# EAGLE design Adafruit VS1053 Breakout (EAGLE 6.4)
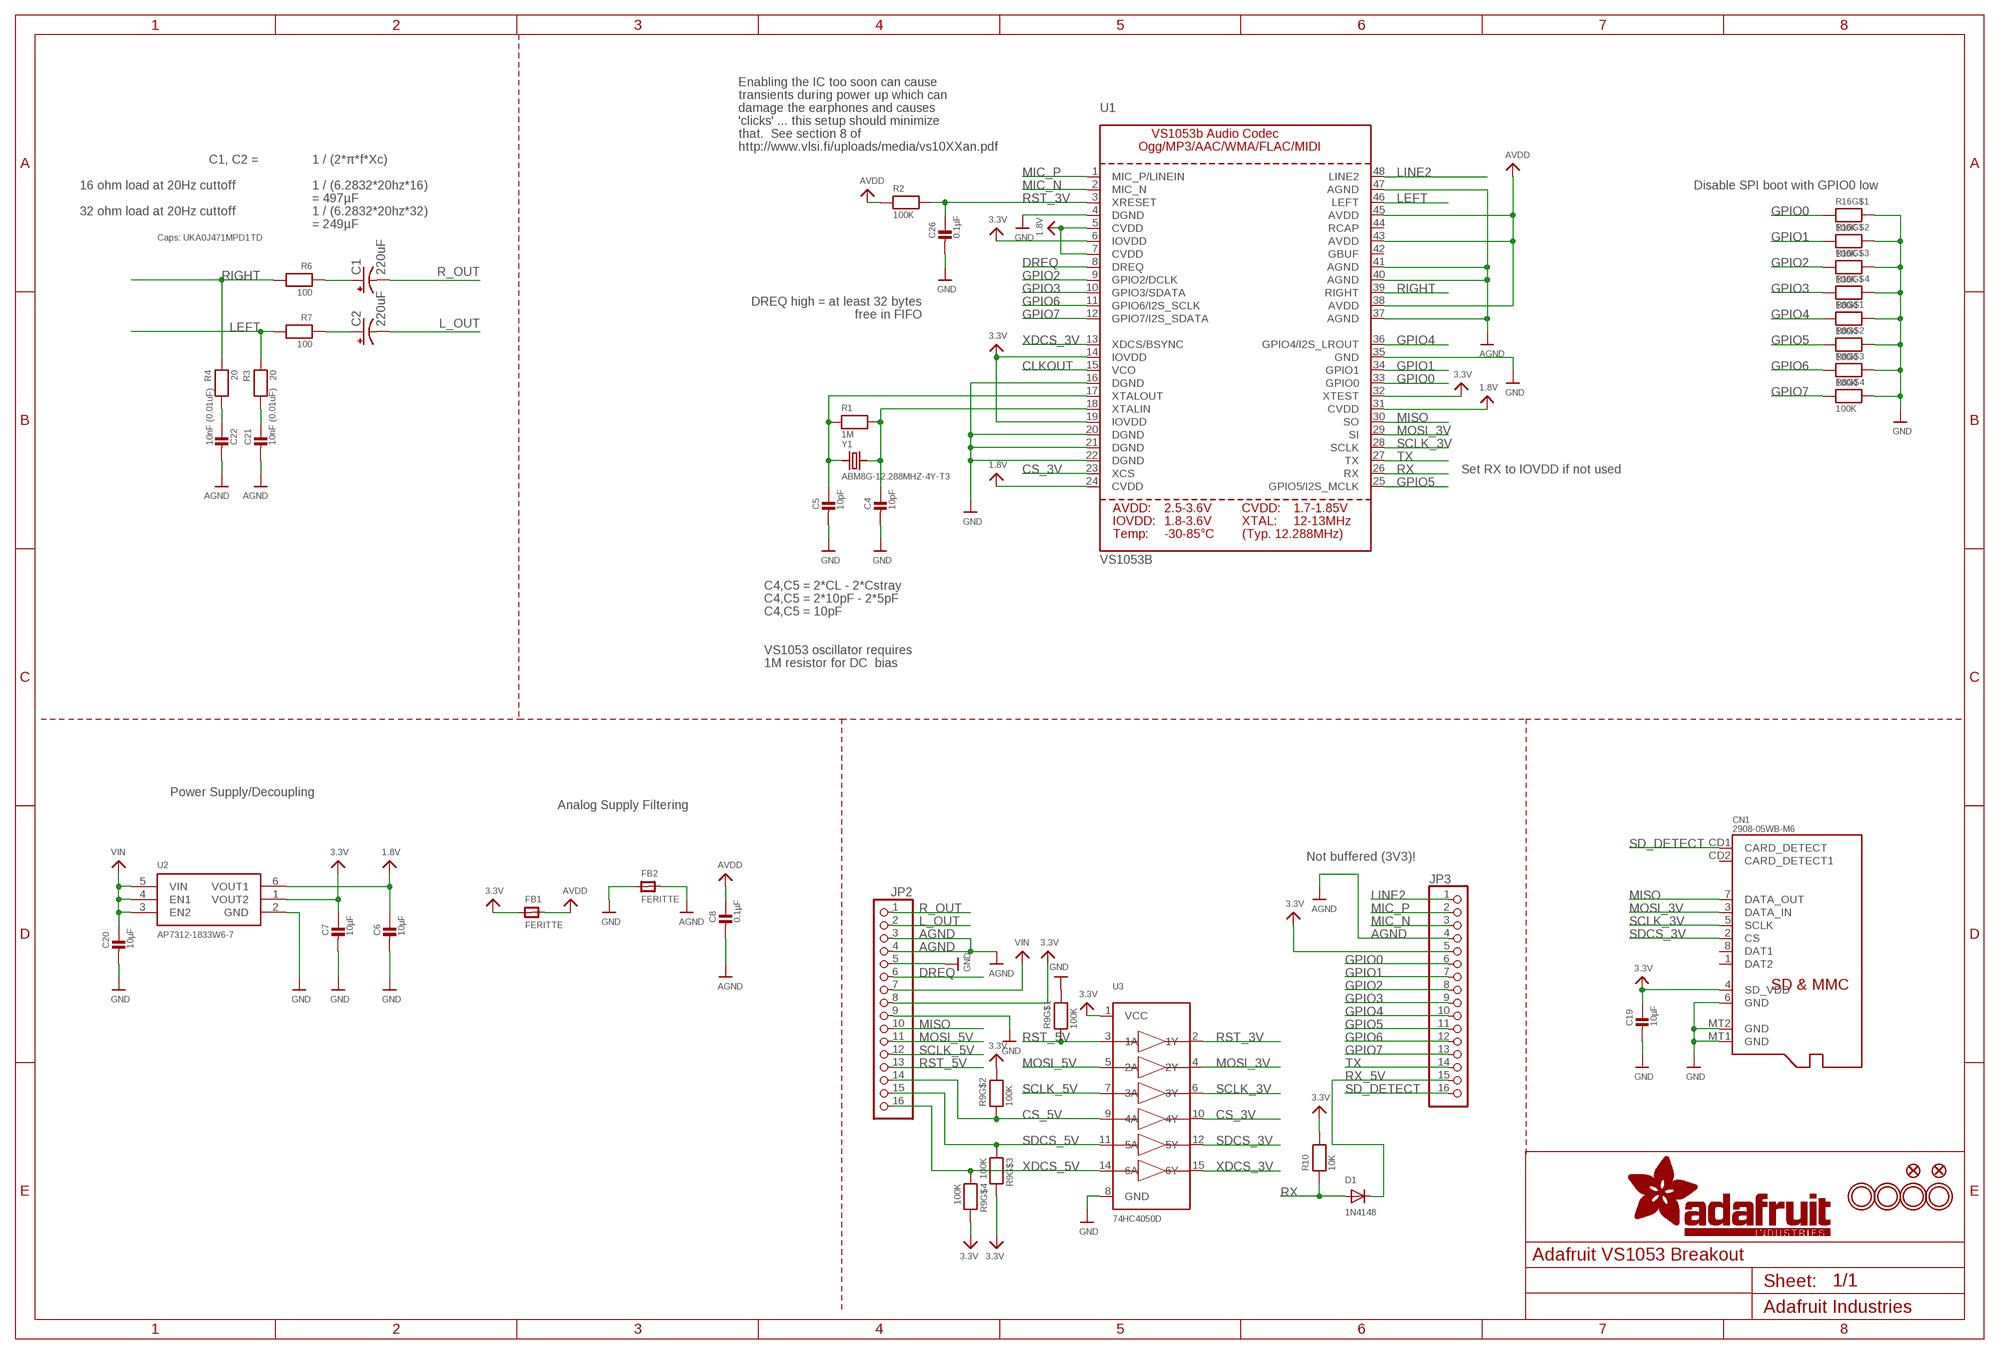
[diagram p0: schematic, sheet 1]

## Parts
C1  220uF  CPOL-USC  [PANASONIC_C]
C2  220uF  CPOL-USC  [PANASONIC_C]
C4  10pF  CAP_CERAMIC_0805MP  [_0805MP]
C5  10pF  CAP_CERAMIC_0805MP  [_0805MP]
C6  10µF  CAP_CERAMIC_0805MP  [_0805MP]
C7  10µF  CAP_CERAMIC_0805MP  [_0805MP]
C8  0.1µF  CAP_CERAMIC_0805MP  [_0805MP]
C19  10µF  CAP_CERAMIC_0805MP  [_0805MP]
C20  10µF  CAP_CERAMIC_0805MP  [_0805MP]
C21  10nF (0.01uF)  CAP_CERAMIC_0805MP  [_0805MP]
C22  10nF (0.01uF)  CAP_CERAMIC_0805MP  [_0805MP]
C26  0.1µF  CAP_CERAMIC_0805MP  [_0805MP]
CN1  2908-05WB-M6  MICROSD  [MICROSD]
D1  1N4148  DIODESOD-323  [SOD-323]
FB1  FERITTE  FERRITE_0805MP  [_0805MP]
FB2  FERITTE  FERRITE_0805MP  [_0805MP]
FID1  FIDUCIAL""  [FIDUCIAL_1MM]
FID2  FIDUCIAL""  [FIDUCIAL_1MM]
JP2  HEADER-1X16ROUND  [1X16_ROUND]
JP3  HEADER-1X16ROUND  [1X16_ROUND]
R1  1M  RESISTOR_0805MP  [_0805MP]
R2  100K  RESISTOR_0805MP  [_0805MP]
R3  20  RESISTOR_0805MP  [_0805MP]
R4  20  RESISTOR_0805MP  [_0805MP]
R6  100  RESISTOR_0805MP  [_0805MP]
R7  100  RESISTOR_0805MP  [_0805MP]
R8  100K  RESISTOR_4PACK  [RESPACK_4X0603]
R9  100K  RESISTOR_4PACK  [RESPACK_4X0603]
R10  10K  RESISTOR0805_NOOUTLINE  [0805-NO]
R16  100K  RESISTOR_4PACK  [RESPACK_4X0603]
U1  VS1053B  [LQFP48]
U2  AP7312-1833W6-7  VREG_SOT23-6_DUALAP7312  [SOT23-6]
U3  74HC4050D  [SOIC16]
U$50  MOUNTINGHOLE3.0THIN  [MOUNTINGHOLE_3.0_PLATEDTHIN]
U$51  MOUNTINGHOLE3.0THIN  [MOUNTINGHOLE_3.0_PLATEDTHIN]
U$52  MOUNTINGHOLE3.0THIN  [MOUNTINGHOLE_3.0_PLATEDTHIN]
U$53  MOUNTINGHOLE3.0THIN  [MOUNTINGHOLE_3.0_PLATEDTHIN]
Y1  ABM8G-12.288MHZ-4Y-T3  CRYSTAL3.2X2.5  [CRYSTAL_3.2X2.5]

## Nets
1.8V: C6.1 U1.5(CVDD) U1.7(CVDD) U1.24(CVDD) U1.31(CVDD) U2.6(VOUT1)
3.3V: C7.1 C19.1 CN1.4(SD_VDD) FB1.1 JP2.8 JP3.5 R9.5 R9.6 R9.7 R10.2 U1.6(IOVDD) U1.14(IOVDD) U1.19(IOVDD) U1.32(XTEST) U2.1(VOUT2) U3.1(VCC)
AGND: C8.2 C21.2 C22.2 FB2.2 JP2.3 JP2.4 JP3.4 U1.37(AGND) U1.40(AGND) U1.41(AGND) U1.47(AGND)
AVDD: C8.1 FB1.2 R2.1 U1.38(AVDD) U1.43(AVDD) U1.45(AVDD)
CLKOUT: U1.15(VCO)
CS_3V: U1.23(XCS) U3.10(4Y)
CS_5V: JP2.14 R9.2 U3.9(4A)
DREQ: JP2.6 U1.8(DREQ)
GND: C4.2 C5.2 C6.2 C7.2 C19.2 C20.2 C26.2 CN1.6(GND) CN1.MT1(GND) CN1.MT2(GND) FB2.1 JP2.5 JP2.9 R8.5 R8.6 R8.7 R8.8 R9.8 R16.5 R16.6 R16.7 R16.8 U1.4(DGND) U1.16(DGND) U1.20(DGND) U1.21(DGND) U1.22(DGND) U1.35(GND) U2.2(GND) U3.8(GND)
GPIO0: JP3.6 R16.1 U1.33(GPIO0)
GPIO1: JP3.7 R16.2 U1.34(GPIO1)
GPIO2: JP3.8 R16.3 U1.9(GPIO2/DCLK)
GPIO3: JP3.9 R16.4 U1.10(GPIO3/SDATA)
GPIO4: JP3.10 R8.1 U1.36(GPIO4/I2S_LROUT)
GPIO5: JP3.11 R8.2 U1.25(GPIO5/I2S_MCLK)
GPIO6: JP3.12 R8.3 U1.11(GPIO6/I2S_SCLK)
GPIO7: JP3.13 R8.4 U1.12(GPIO7/I2S_SDATA)
L_OUT: C2.- JP2.2
LEFT: R3.1 R7.2 U1.46(LEFT)
LEFT_FILTERED: C2.+ R7.1
LINE2: JP3.1 U1.48(LINE2)
MIC_N: JP3.3 U1.2(MIC_N)
MIC_P: JP3.2 U1.1(MIC_P/LINEIN)
MISO: CN1.7(DATA_OUT) JP2.10 U1.30(SO)
MOSI_3V: CN1.3(DATA_IN) U1.29(SI) U3.4(2Y)
MOSI_5V: JP2.11 U3.5(2A)
N$1: C5.1 R1.1 U1.17(XTALOUT) Y1.1
N$2: C4.1 R1.2 U1.18(XTALIN) Y1.2
N$5: C21.1 R3.2
N$6: C22.1 R4.2
R_OUT: C1.- JP2.1
RIGHT: R4.1 R6.2 U1.39(RIGHT)
RIGHT_FILTERED: C1.+ R6.1
RST_3V: C26.1 R2.2 U1.3(XRESET) U3.2(1Y)
RST_5V: JP2.13 R9.1 U3.3(1A)
RX: D1.A R10.1 U1.26(RX)
RX_5V: D1.C JP3.15
SCLK_3V: CN1.5(SCLK) U1.28(SCLK) U3.6(3Y)
SCLK_5V: JP2.12 U3.7(3A)
SD_DETECT: CN1.CD1(CARD_DETECT) JP3.16
SDCS_3V: CN1.2(CS) U3.12(5Y)
SDCS_5V: JP2.15 R9.3 U3.11(5A)
TX: JP3.14 U1.27(TX)
VIN: C20.1 JP2.7 U2.3(EN2) U2.4(EN1) U2.5(VIN)
XDCS_3V: U1.13(XDCS/BSYNC) U3.15(6Y)
XDCS_5V: JP2.16 R9.4 U3.14(6A)
Unconnected: CN1.1(DAT2) CN1.8(DAT1) CN1.CD2(CARD_DETECT1) U1.42(GBUF) U1.44(RCAP)

## Notes on the sheet
- Enabling the IC too soon can cause
- transients during power up which can
- damage the earphones and causes
- 'clicks' ... this setup should minimize
- that.  See section 8 of
- http://www.vlsi.fi/uploads/media/vs10XXan.pdf
- C1, C2 = | 1 / (2*π*f*Xc)
- 16 ohm load at 20Hz cuttoff | 1 / (6.2832*20hz*16) | Disable SPI boot with GPIO0 low
- = 497µF
- 32 ohm load at 20Hz cuttoff | 1 / (6.2832*20hz*32)
- = 249µF
- Caps: UKA0J471MPD1TD
- DREQ high = at least 32 bytes
- free in FIFO
- Set RX to IOVDD if not used
- C4,C5 = 2*CL - 2*Cstray
- C4,C5 = 2*10pF - 2*5pF
- C4,C5 = 10pF
- VS1053 oscillator requires
- 1M resistor for DC  bias
- Power Supply/Decoupling
- Analog Supply Filtering
- Not buffered (3V3)!

## Library data of the parts
C1 C2 = rcl:CPOL-US: POLARIZED CAPACITOR, American symbol
C4-C8 C19-C22 C26 = microbuilder:CAP_CERAMIC: Ceramic Capacitors For new designs, use the packages preceded by an '_' character since they are more reliable: The following footprints should be used on most boards: _0402 - Standard footprint for regular board layouts _0603 - Standard footprint for regular board layouts _0805 - Standard footprint for regular board layouts For extremely tight-pitch boards where space is at a premium, the following 'micro-pitch' footprints can be used (smaller pads, no silkscreen outline, etc.): _0402MP - Micro-pitch footprint for very dense/compact boards _0603MP - Micro-pitch footprint for very dense/compact boards _0805MP - Micro-pitch footprint for very dense/compact boards Commonly Stocked Parts 0402 - 0402 Surface Mount Capacitors 16pF 50V 5% [Digikey: 445-4899-2-ND] 18pF 50V 5% [Digikey: 490-1281-2-ND] 22pF 50V 5% [Digikey: 490-1283-2-ND] 68pF 50V 5% [Digikey: 490-1289-2-ND] 0.1uF 10V 10% [Digikey: 490-1318-2-ND] 1.0uF 6.3V 10% [Digikey: 490-1320-2-ND] 0603 - 0603 Surface Mount Capacitors 16 pF 50V 5% [Digikey: 445-5051-2-ND] 22 pF 50V [Digikey: PCC220ACVTR-ND] 33 pF 50V 5% [Digikey: 490-1415-1-ND] 56pF 50V 5% [Digikey: 490-1421-1-ND] 220pF 50V 5% [Digikey: 445-1285-1-ND] 680 pF 50V 2200 pF 50V 5% C0G [Digikey: 445-1297-1-ND] 5600 pF 100V 5% X7R [Digikey: 478-3711-1-ND] 0.1 µF 25V 10% [Digikey: PCC2277TR-ND] 0.22 µF 16V 10% X7R [Digikey: 445-1318-1-ND] 1.0 µF 25V 10% [Digikey: 445-5146-2-ND] 0603 - RF Specific 3pF 250V +/-0.1pF RF [Digikey: 712-1347-1-ND] 18 pF 250V 5% [Digikey: 478-3505-1-ND or 712-1322-1-ND] 56 pF 250V 5% C0G RF [Digikey: 490-4867-1-ND] 68 pF 250V RF [Digikey: 490-4868-1-ND] 0805 - 0805 Surface Mount Capacitors 220 pF 250V 2% RF Ceramic Capacitor [Digikey: 712-1398-1-ND] 1000 pF 50V 2% NP0 Ceramic Capacitor [Digikey: 478-3760-1-ND] 0.1 µF 25V 10% Ceramic Capacitor [Digikey: PCC1828TR-ND] 1.0 µF 16V 10% Ceramic Capacitor[Digikey: 490-1691-2-ND] 10.0 µF 10V 10% Ceramic Capacitor[Digikey: 709-1228-1-ND] 10.0 uF 16V 10% Ceramic Capacitor [Digikey: 478-5165-2-ND] 47 uF 6.3V 20% Ceramic Capacitor [Digikey: 587-1779-1-ND or 399-5506-1-ND] 1206 - 1206 Surface Mount Capacitors 47uF 10V 20% Ceramic Capacitor [Digikey: 490-5528-1-ND or 399-5508-1-ND or 445-6010-1-ND] 100uF 6.3V -20%, +80% Y5V Ceramic Capacitor (Digikey: 490-4512-1-ND, Mouser: 81-GRM31CF50J107ZE1L)
CN1 = microbuilder:MICROSD: MicroSD/Transflash Card Holder with SPI pinout 3M: 2908-05WB-MG 4UConnector: 19656 Footprint courtesy: Adafruit Industries
D1 = microbuilder:DIODE: Diode SMA Model Volts Amps Type Vf Vr Digikey # Notes SSA34-E3 40V 3A Schottky 480mV @ 3A 200uA @ 40V SSA34-E3/61TGITR-ND CDBA120-G 20V 1A Schottky 500mV @ 1A 500uA @ 20V 641-1014-6-ND REEL MBRA210 10V 2A Schottky 350mV @ 2A 700uA @ 10V MBRA210LT3 SOD-123 Model Volts Amps Type Vf Vr Order # Notes BAT54T1G 30V 200mA Schottky 800mV @ 200mA 2uA @ 25V BAT54T1GOSTR-ND B0530W 30V 500mA Schottky 430mV @ 500mA 130uA @ 30V B0530W-FDICT-ND REEL MBR120 20V 1A Schottky 340mV @ 1A MBR120VLSFT1GOSCT-ND SOD-323 Model Volts Amps Type Vf Vr Order # Notes PMEG2005EJ 20V 500mA Schottky 355mV @ 500mA 568-4110-1-ND ZLLS410 10V 570mA Schottky 380mV @ 570mA ZLLS410CT-ND 1N4148WS 75V 150mA Silicon/Simple 1V 1N4148WSFSCT-ND REEL SOD-523 Model Volts Amps Type Vf Vr Order # Notes BAT54XV2 30V 200mA Schottky 0.8V @ 100mA BAT54XV2CT-ND TB751S 30V 30mA Schottky RB751S-40TE61CT-ND SOT23-R/W (R = Solder Paste/Reflow Ovens, W = Hand-Soldering) Model Volts Amps Type Vf Vr Order # Notes BAT54FILM 40V 300mA Schottky 497-7162-1-ND
FB1 FB2 = microbuilder:FERRITE: Ferrite Bead 0603 MMZ1608B121C - 120 Ohm @ 100MHz, 600mA, 0.15 Ohm DC Resistance - Digikey: 445-2164-1-ND BK1608HW121-T - 120 Ohm, 600mA Ferrite Chip - Digikey: 587-1876-2-ND 0805 HZ0805B272R-10 - 2.7K Ohm @ 100MHz, 200mA, 0.8 Ohm DC Resistance - Digikey: 240-2504-1-ND (see also Murata BLM21BD272SN1L) MMZ2012Y152B - 1.5K Ohm @ 100MHz, 500mA, 0.4 Ohm DC Resistance - Digikey: 445-1560-1-ND - Mainly for high frequency (80-400MHz) MMZ2012R102A - 1K Ohm @ 100MHz, 500mA, 0.3 Ohm DC Resistance - Digikey: 445-1555-2-ND - More general purpose (10-200MHz)
FID1 FID2 = microbuilder:FIDUCIAL: Fiducial Alignment Points Various fiducial points for machine vision alignment.; BOM: EXCLUDE
JP2 JP3 = microbuilder:HEADER-1X16: PIN HEADER
R1-R4 R6 R7 R10 = microbuilder:RESISTOR: Resistors For new designs, use the packages preceded by an '_' character since they are more reliable: The following footprints should be used on most boards: _0402 - Standard footprint for regular board layouts _0603 - Standard footprint for regular board layouts _0805 - Standard footprint for regular board layouts For extremely tight-pitch boards where space is at a premium, the following 'micro-pitch' footprints can be used (smaller pads, no silkscreen outline, etc.): _0402MP - Micro-pitch footprint for very dense/compact boards _0603MP - Micro-pitch footprint for very dense/compact boards _0805MP - Micro-pitch footprint for very dense/compact boards
R8 R9 R16 = microbuilder:RESISTOR_4PACK: Resistor Packs (4 resistors) 4 x 0603 10K 1/16W - Digikey: YC164J-10KCT-ND
U1 = microbuilder:VS1053B: VS1053b Audio Codec - Ogg Vorbis/MP3/AAC/WMA/FLAC/MIDI
U2 = microbuilder:VREG_SOT23-6_DUAL: Dual Output SOT23-6 Linear Regulators Diodes Inc. AP7312 - Dual 150mA LDO Linear Regulator 0.2V dropout, 150mA output, 2-6V Input AP7312-1833W6-7 - 1.8V/3.3V SOT23-6 (Digikey: AP7312-1833W6-7DICT-ND) MIC5320 - Dual 150mA ULDO Linear Regulator Ultra-low 35mV dropout at 150mA, 2.3-5.5V Input 3.3V/1.8V SOT23-6 (Digikey: 576-1658-1-ND) 3.3V/1.5V SOT23-6 (Digikey: 576-3483-1-ND)
U3 = microbuilder:74HC4050D: 6-channel level shifter 74HC4050D - 2V-6V Supply SOIC16 Digikey: 74HC4050D,653-ND Mouser: 771-74HC4050D-T TSSOP16 Digikey: 296-9215-1-ND Mouser:
U$50-U$53 = microbuilder:MOUNTINGHOLE: Mounting Hole For #2 screws (0.086"/2.18mm width, 0.094"/2.4mm hole) use 2.5mm; BOM: EXCLUDE
Y1 = microbuilder:CRYSTAL: Crystals HC49UP - Surface Mount Crystal 4.0MHz 18pF +/-30ppm Surface Mount Crystal [Digikey: 535-9857-1-ND] 12.0 MHz Surface Mount Crystal [Digikey: 535-9869-6-ND] 25.0 MHz Surface Mount Crystal [Digikey: 535-9078-1-ND] 2.5 x 2.0mm - MEMs SMT Crystal 16.0 MHz 10pF 20ppm 2.5 x 2.0mm Crystal [Digikey -40-85°C: 535-10923-1-ND] 3.2 x 2.5mm - MEMs SMT Crystal 12.0 MHz 8pF 15ppm 3.2 x 2.5mm Crystal [Digikey: -10-70°C: 644-1047-1-ND -40-125°C: 644-1128-1-ND] 40~85°C cheaper: 644-1173-6-ND 16.0 MHz 8pF 15ppm 3.2 x 2.5mm Crystal [Digikey: -10-70°C: 644-1049-1-ND -40-125°C: 644-1129-2-ND]-40~85°C cheaper: 644-1175-6-ND 16.0 MHz 10pF 10ppm 3.2 x 2.5mm Crystal [Digikey: 644-1100-1-ND] 27.12 MHz 18pF 30ppm 3.2 x 2.5mm Crystal [Digikey: 887-1424-1-ND] 27.12MHz 10pF 10ppm 3.2 x 2.5mm Crystal [Digikey: 887-1329-1-ND] 4.9 x 1.8mm - MEMs SMT Crystal 32.768 KHz 12.5pF 20ppm 4.9 x 1.8mm Crystal [Digikey: SE2415CT-ND] 8.0 x 3.8mm - Surface Mount Crystal 32.768kHz 12.5pF 20ppm -40°C-85°C [Digikey: 535-9166-2-ND] Cylinder 32.768KHz Cylinder Crystal (2x6mm body) [Ex. Digikey: 300-8341-2-ND]

## Board
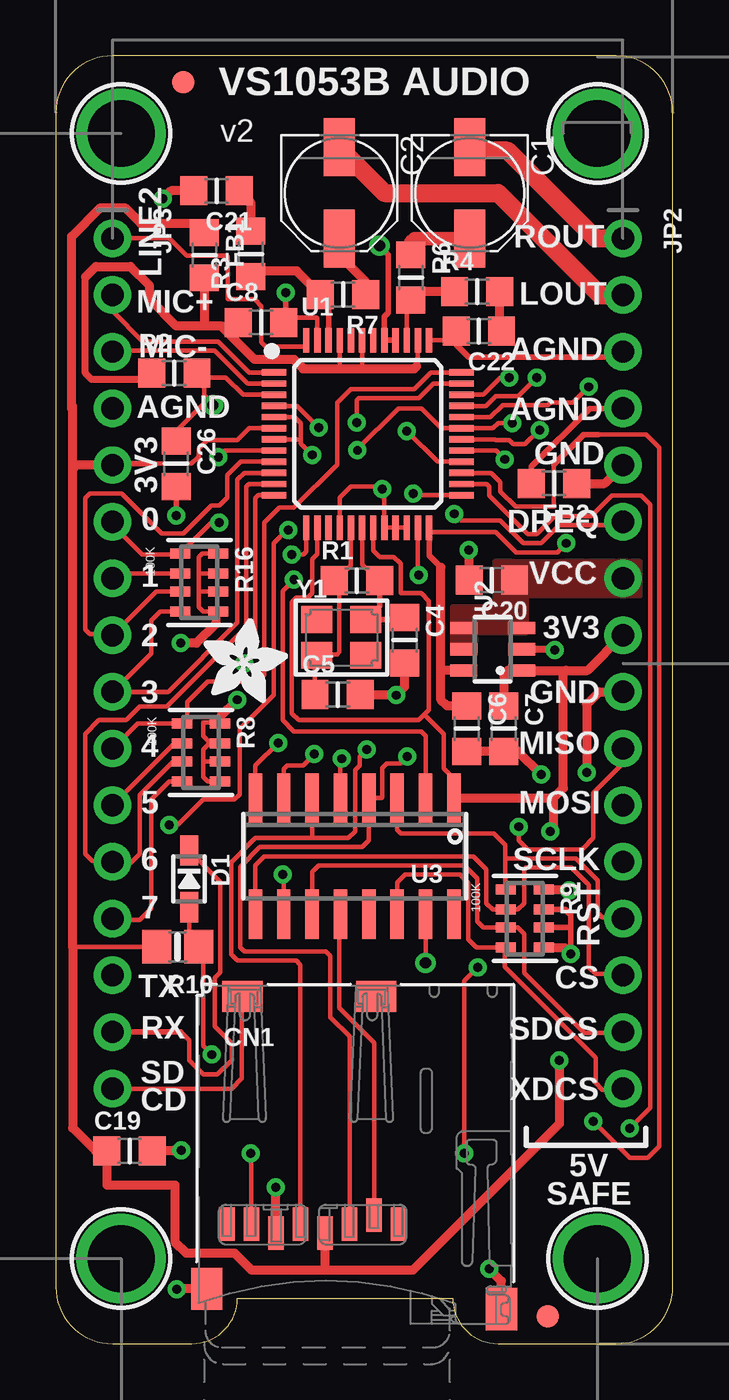
[diagram p1: board, top side]
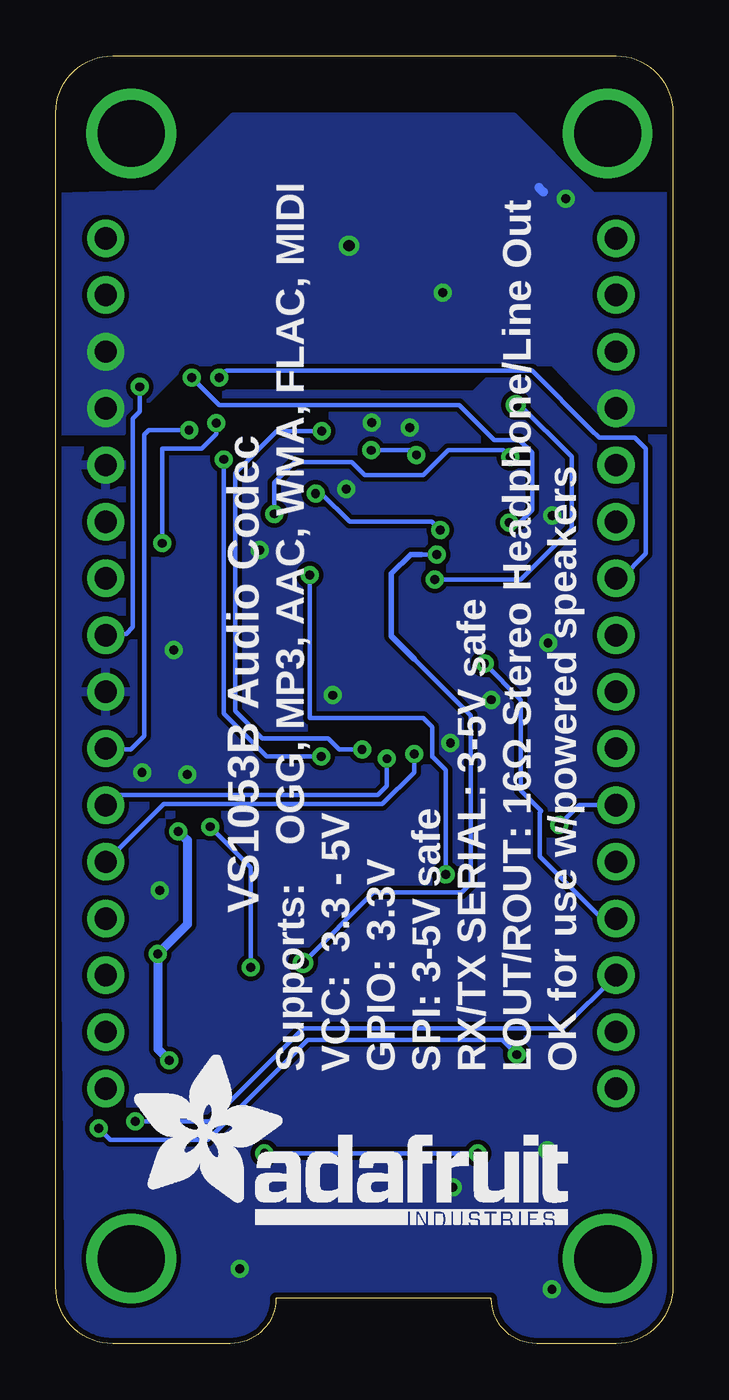
[diagram p2: board, bottom side, seen from below]

Size 27.64 x 57.71 mm. Coordinates in mm from the lower left corner, seen from the top.
Outline: 19.81,0 25.09,0 arc90 27.64,2.54 27.64,55.17 arc90 25.09,57.71 2.54,57.71 arc90 0,55.17 0,2.54 arc90 2.54,0 6.1,0 arc90 8.13,2.03 17.78,2.03 arc90 19.81,0
Copper layers (1*16): Top 0.035mm / dielectric 1.5mm / Bottom 0.035mm
Design rules "adafruit *": minimum track width 8mil, minimum drill 15.5mil, track to track 8mil, track to pad 8mil, pad to pad 8mil, via to via 8mil, smd to smd 8mil, copper to edge 10mil, drill to drill 8mil, minimum pad ring 10mil, minimum via ring 8mil, stop-mask expansion 4mil, vias tented up to drill 20mil, thermal gap 10mil

### Footprints (pad centres in the part's own frame; a part is rotated, then mirrored left to right if it is on the bottom)
PANASONIC_C = smd 2.6 x 1.4: + 2.05,0; - -2.05,0
_0805MP = smd 1.2 x 1.3: 1 -1.016,0; 2 1.016,0
MICROSD = smd 0.7 x 1.5: 1 9,-10.64; 2 7.9,-10.24; 3 6.8,-10.64; 4 5.7,-11.04; 5 4.6,-10.64; 6 3.5,-11.04; 7 2.4,-10.64; 8 1.3,-10.64 | smd 1.8 x 1.4: CD1 2,-0.44; CD2 8,-0.44 | smd 1.4 x 1.9: MT1 0.4,-13.54; MT2 13.6,-14.44
SOD-323 = smd 1.35 x 0.8: A 1.27,0; C -1.27,0
FIDUCIAL_1MM = smd 1 x 1: 1 0,0
1X16_ROUND = drill 1 pad 1.676: 1 -19.05,0; 2 -16.51,0; 3 -13.97,0; 4 -11.43,0; 5 -8.89,0; 6 -6.35,0; 7 -3.81,0; 8 -1.27,0; 9 1.27,0; 10 3.81,0; 11 6.35,0; 12 8.89,0; 13 11.43,0; 14 13.97,0; 15 16.51,0; 16 19.05,0
RESPACK_4X0603 = smd 0.45 x 0.9: 1 -1.3,-0.85; 2 -0.4,-0.85; 3 0.4,-0.85; 4 1.3,-0.85; 5 1.3,0.85; 6 0.4,0.85; 7 -0.4,0.85; 8 -1.3,0.85
0805-NO = smd 1.3 x 1.5: 1 -0.95,0; 2 0.95,0
LQFP48 = smd 1.1 x 0.285: 1 -4.2,2.75; 2 -4.2,2.25; 3 -4.2,1.75; 4 -4.2,1.25; 5 -4.2,0.75; 6 -4.2,0.25; 7 -4.2,-0.25; 8 -4.2,-0.75; 9 -4.2,-1.25; 10 -4.2,-1.75; 11 -4.2,-2.25; 12 -4.2,-2.75; 25 4.2,-2.75; 26 4.2,-2.25; 27 4.2,-1.75; 28 4.2,-1.25; 29 4.2,-0.75; 30 4.2,-0.25; 31 4.2,0.25; 32 4.2,0.75; 33 4.2,1.25; 34 4.2,1.75; 35 4.2,2.25; 36 4.2,2.75 | smd 0.285 x 1.1: 13 -2.75,-4.2; 14 -2.25,-4.2; 15 -1.75,-4.2; 16 -1.25,-4.2; 17 -0.75,-4.2; 18 -0.25,-4.2; 19 0.25,-4.2; 20 0.75,-4.2; 21 1.25,-4.2; 22 1.75,-4.2; 23 2.25,-4.2; 24 2.75,-4.2; 37 2.75,4.2; 38 2.25,4.2; 39 1.75,4.2; 40 1.25,4.2; 41 0.75,4.2; 42 0.25,4.2; 43 -0.25,4.2; 44 -0.75,4.2; 45 -1.25,4.2; 46 -1.75,4.2; 47 -2.25,4.2 | smd 0.28 x 1.1: 48 -2.75,4.2
SOT23-6 = smd 0.55 x 1.2: 1 -0.95,-1.3; 2 0,-1.3; 3 0.95,-1.3; 4 0.95,1.3; 5 0,1.3; 6 -0.95,1.3
SOIC16 = smd 0.6 x 2.2: 1 -4.445,-2.6; 2 -3.175,-2.6; 3 -1.905,-2.6; 4 -0.635,-2.6; 5 0.635,-2.6; 6 1.905,-2.6; 7 3.175,-2.6; 8 4.445,-2.6; 9 4.445,2.6; 10 3.175,2.6; 11 1.905,2.6; 12 0.635,2.6; 13 -0.635,2.6; 14 -1.905,2.6; 15 -3.175,2.6; 16 -4.445,2.6
MOUNTINGHOLE_3.0_PLATEDTHIN = drill 3 pad 3.6: P$1 0,0
CRYSTAL_3.2X2.5 = smd 1.4 x 1.2: 1 -1.1,-0.8; 2 1.1,0.8; GND1 -1.1,0.8; GND2 1.1,-0.8

### Placement (x,y rotation side)
C1  18.54,51.56 270 top
C2  12.7,51.56 270 top
C4  15.62,31.52 270 top
C5  12.62,29.08 0 top
C6  18.41,27.56 270 top
C7  20.07,27.56 270 top
C8  9.19,45.76 0 top
C19  3.3,8.64 0 top
C20  19.53,34.21 180 top
C21  7.2,51.66 180 top
C22  18.95,45.37 180 top
C26  5.38,39.43 270 top
CN1  6.36,16 0 top
D1  5.97,20.83 270 top
FB1  6.66,48.77 270 top
FB2  22.32,38.55 180 top
FID1  5.71,56.52 0 top
FID2  22.04,1.22 0 top
JP2  25.4,30.48 270 top
JP3  2.54,30.48 270 top
R1  13.49,34.19 0 top
R2  5.31,43.49 0 top
R3  8.73,48.83 90 top
R4  18.87,47.14 0 top
R6  15.91,47.77 270 top
R7  12.86,47.01 180 top
R8  6.5,26.49 270 top
R9  21.01,19.05 270 top
R10  5.46,17.78 180 top
R16  6.43,34.11 270 top
U1  13.97,40.77 0 top
U2  19.57,31.12 90 top
U3  13.39,21.84 180 top
U$31  [ADAFRUIT_3.5MM]  6.6,28.7 0 top
U$50  2.92,3.81 0 top
U$51  24.26,3.81 0 top
U$52  24.26,54.23 0 top
U$53  2.92,54.23 0 top
U$55  [ADAFRUIT_TEXT_20MM]  24.28,5.33 0 bottom
Y1  12.79,31.64 0 top

### Tracks (layer width: path | path; a pad name or v marks a point on that pad's centre or on a via)
1.8V  (via drill 0.4)
  Top 0.203: U1.5 10.71,41.52 10.97,41.25 10.97,40.54 | 10.97,40.54 10.97,40.34 v11.48,39.83 | U1.7 10.95,40.52 10.97,40.54 | v22.86,35.87 22.45,35.46 20.62,35.46 19.71,36.37 16.76,36.37 16.72,36.42 U1.24 | v13.51,40.03 13.46,40.03 15.34,41.91 16.38,41.91 17.27,41.02 U1.31 | v20.45,41.25 19.82,41.25 19.81,41.25 19.58,41.02 U1.31 | U1.31
  Top 0.254: U1.24 16.72,35.33 17.25,34.8
  Top 0.406: C6.1 17.53,28.57 17.25,28.85 17.25,30.23 | 17.25,30.23 17.25,34.8 | U2.6 17.3,30.17 17.25,30.23
  Bottom 0.203: v13.51,40.03 11.68,40.03 v11.48,39.83 | v22.86,35.87 22.86,40.1 21.1,40.1 20.45,40.75 v20.45,41.25
3.3V  (via drill 0.4)
  Top 0.203: 16.51,28.19 16.71,28.4 16.71,33.27 16.36,33.63 15.44,33.63 15.44,34.95 15.14,35.26 14.5,35.26 14.22,35.54 U1.19 | 16.51,28.19 16.26,27.94 10.87,27.94 10.57,28.25 10.57,33.22 10.77,33.43 11.28,33.43 11.48,33.63 11.48,35.15 11.72,35.39 U1.14 | U3.1 17.78,24.5 17.78,25.38 17.37,25.78 17.37,27.33 16.51,28.19 | v23.88,42.88 23.16,42.16 22.15,42.16 22.04,42.06 20.01,42.06 19.47,41.52 U1.32 | U1.6 8.66,41.02 8.13,40.49 6.79,40.49 6.4,40.1 6.4,39.76 | 6.4,39.76 6.4,39.7 | 4.42,39.43 6.07,39.43 6.4,39.76 | R10.2 0.75,17.78
  Top 0.254: R9.7 22.82,19.45 23.06,19.2 23.06,18.59 | 23.06,18.59 v23.06,17.48 | R9.6 23.01,18.65 23.06,18.59 | 4.42,39.43 2.6,39.43 JP3.5
  Top 0.406: 0.71,41.91 0.71,42.04 | 0.71,42.04 0.71,49.61 2,50.9 3.1,50.9 3.8,50.2 6.5,50.2 6.5,49.95 FB1.1 | C7.1 20.07,29.97 20.26,30.17 U2.1 22.86,30.17 | 22.86,30.17 23.82,30.17 JP2.8 | U3.1 22.29,24.44 | 22.29,24.44 22.73,24.89 22.73,30.04 22.86,30.17 | CN1.4 12.06,3.38 11.99,3.3 | R9.5 22.79,17.75 v23.06,17.48 | v22.55,12.7 22.55,9.86 16,3.3 11.99,3.3 | 11.99,3.3 8.76,3.3 8,4.06 5.84,4.06 5.33,4.57 5.33,7.11 2.29,7.11 C19.1 1.78,8.64 0.75,9.67 0.75,17.78 0.75,39.2 | 22.29,24.44 22.29,23.1 v22.15,22.96 | 0.75,39.2 0.75,42 0.71,42.04 | JP3.5 0.92,39.37 0.75,39.2
  Bottom 0.203: v23.88,42.88 23.88,41.76 24.18,41.45 24.18,32.11 24.49,31.8 25.35,31.8 JP2.8
  Bottom 0.406: v22.55,12.7 23.06,13.21 v23.06,17.48 21.74,18.8 21.74,22.55 v22.15,22.96
AGND  (via drill 0.4, 0.5)
  Top 0.203: U1.37 17.8,44.97 17.94,44.83 | U1.47 11.72,45.94 11.68,45.97 10.42,45.97 C8.2
  Top 0.254: FB2.2 21.3,39.3 23.91,41.91 JP2.4 | C22.2 17.94,44.83 17.94,44.76 18.5,44.2 25.15,44.2 JP2.3 | U1.40 U1.41 14.72,46.02 14.9,46.2 14.9,48.8 v14.5,49.2 | 10.3,45.85 v10.3,47.1 | 10.64,46.2 10.56,46.12 | 10.56,46.12 10.3,45.85 | 10.54,46.12 10.56,46.12 | 10.3,45.85 C8.2
  Top 0.406: C21.2 5.16,51.66 v4.8,51.3
  Bottom 0.254: v14.5,49.2 14.6,49.2 14.7,49.3
  Bottom 0.406: 6,51.8 5.8,51.6
  pour Bottom (no thermals): 0,41.18 2.77,41.18 5.38,43.89 21.84,43.89 24.59,41.15 24.59,40.8 26.11,40.8 27.61,40.78 27.61,51.49 23.16,51.61 19.71,55.07 7.11,55.07 3.56,51.51 0,51.51
AVDD
  Top 0.203: U1.38 16.22,43.85 16.15,43.79 | 13.82,43.69 13.72,43.79 U1.43 | U1.45 12.72,43.71 12.7,43.69 | 3.71,43.2 4.09,43.59 | 8.01,45.6 8.18,45.6 C8.1
  Top 0.254: 4.09,43.59 4.19,43.59 R2.1 | 7.71,45.6 8.01,45.6
  Top 0.305: 3.71,43.2 1.6,43.2 1.32,43.48 1.32,47.79
  Top 0.406: 16.15,43.79 16.05,43.69 13.82,43.69 12.7,43.69 11.07,43.69 10.66,44.1 8.9,44.1 7.4,45.6 | 1.32,47.79 1.79,48.26 3.34,48.26 4.2,47.4 4.2,46.8 5.4,45.6 6.7,45.6 | 7.4,45.6 6.7,45.6 | 7.4,45.6 7.71,45.6 | FB1.2 6.66,45.64 6.7,45.6
CS_3V  (via drill 0.4)
  Top 0.203: U3.10 10.21,20.98 v10.16,21.03 | U1.23 16.22,34.48 v16.26,34.44
  Bottom 0.203: v10.16,21.03 10.16,25.7 10.74,26.29 10.77,26.29 10.77,27.64 11.18,28.04 16.26,28.04 v16.26,34.44
CS_5V
  Top 0.203: U3.9 8.94,21.44 9.35,21.84 18.69,21.84 19.28,21.26 19.28,19.74 19.56,19.45 R9.2 20.7,19.45 20.98,19.74 20.98,21.26 21.06,21.34 23.09,21.34 23.88,20.55 23.88,16.87 24.18,16.56 25.35,16.56 JP2.14
DREQ  (via drill 0.4)
  Top 0.203: 25.35,36.88 JP2.6 25.25,36.68 22.55,36.68 21.74,35.87 20.93,35.87 19.91,36.88 18.16,36.88 v17.86,37.19 | U1.8 7.58,40.02 v7.29,39.73
  Bottom 0.203: v7.29,39.73 7.59,40.03 10.06,40.03 11.18,38.91 13.79,38.91 14.38,39.5 16.94,39.5 17.86,38.58 v17.86,37.19 17.88,37.19
GND  (via drill 0.4)
  Top 0.203: R8.5 6.81,25.19 6.6,25.4 6.6,26.11 | 6.6,26.11 6.6,26.62 6.88,26.89 R8.7 6.94,26.89 6.6,27.23 6.6,27.84 7.31,27.84 R8.8 | R8.6 6.62,26.09 6.6,26.11 | R16.8 6.56,35.41 6.4,35.26 6.4,34.54 | 6.4,34.54 6.4,33.73 | 6.4,33.73 6.4,33.02 6.6,32.82 7.17,32.82 | R16.6 6.42,33.71 6.4,33.73 | R16.7 6.43,34.51 6.4,34.54 | U1.16 12.72,37.92 13.21,38.41 14.53,38.41 v14.63,38.3 14.72,38.21 U1.20 U1.21 U1.22 | U1.35 16.91,43.02 16.26,42.37 13.56,42.37 13.49,42.29 v13.49,41.27 | U1.4 10.81,42.02 v11.79,41.05 | U3.8 8.94,25.91 v9.96,26.92 | 7.37,28.1 7.38,28.09
  Top 0.254: C26.2 5.38,37.12 v5.4,37.1
  Top 0.305: U2.2 22.32,31.12 v22.35,31.09
  Top 0.406: v8.13,28.85 7.37,28.1 7.37,27.81 R8.8 | v5.59,31.39 6.3,31.39 7.18,32.27 7.18,32.71 R16.5 7.18,32.81 7.17,32.82 | C20.2 18.52,35.53 v18.49,35.56 | v23.77,25.6 23.77,28.65 24.33,29.21 JP2.9 | C6.2 C7.2 20.7,26.54 v21.74,25.5 | C5.2 15.21,29.08 v15.24,29.06 15.62,29.44 C4.2 | R9.8 22.96,20.35 v22.99,20.32 | CN1.6 v9.86,7.01 | CN1.MT1 5.43,2.46 v5.41,2.44 | CN1.MT2 19.96,2.8 v19.41,3.35 | v5.61,8.66 5.59,8.64 C19.2 | FB2.1 24.58,38.55 JP2.5
  pour Bottom: 0,40.57 2.77,40.47 5.8,43.2 8.1,43.3 8.9,42.5 21.54,42.57 23.27,40.84 23.27,39.99 27.43,39.99 27.03,0 0,0
GPIO0  (via drill 0.4)
  Top 0.203: JP3.6 2.54,36.68 3.86,35.36 5.62,35.36 5.62,35.37 R16.1 6.95,36.79 7.05,36.79 | v21.54,43.28 20.72,42.47 19.71,42.47 19.26,42.02 U1.33
  Top 0.254: 7.05,36.79 v7.32,36.79
  Bottom 0.203: v21.54,43.28 20.32,42.06 9.56,42.06 8,40.5 6.87,40.5 6.3,39.93 6.3,37.35 6.86,36.79
  Bottom 0.254: 6.86,36.79 | 6.86,36.79 v7.32,36.79
GPIO1  (via drill 0.4)
  Top 0.203: 2.56,34.31 JP3.7 2.76,34.51 R16.2 | U1.34 19.15,42.52 19.91,43.28 v20.32,43.28
  Bottom 0.203: 20.22,43.18 v20.32,43.28 20,43.6 6.3,43.6 3.66,40.96 3.3,40.6 1.7,40.6 1.2,40.1 1.2,35.4 2.31,34.29 JP3.7
GPIO2
  Top 0.203: R16.3 4.5,33.71 JP3.8 2.49,31.8 1.52,31.8 1.32,32 1.32,37.9 1.52,38.1 2.95,38.1 4.75,36.3 5.7,36.3 6.96,37.55 7.32,37.55 7.67,37.91 7.67,38.91 8.28,39.52 U1.9
GPIO3
  Top 0.203: U1.10 8.44,39.02 8.13,38.71 8.13,32.31 5.03,29.21 JP3.9 4.27,30.94 4.27,32.41 4.67,32.81 R16.4
  Bottom 0.203: 2.59,29.16 JP3.9
GPIO4
  Top 0.203: JP3.10 3.66,27.79 R8.1 5.89,28.03 5.89,28.75 6.81,29.67 9.04,29.67 9.35,29.97 9.35,36.8 10.01,37.47 10.67,37.47 12.6,39.4 12.6,42.16 13.21,42.77 16.05,42.77 16.8,43.52 U1.36
GPIO5  (via drill 0.4)
  Top 0.203: R8.2 5.3,26.89 JP3.11 | v5.08,23.24 5.46,23.24 6.6,24.38 8,24.38 8.23,24.61 8.23,27.53 9.75,29.06 9.75,35.87 10.34,36.45 v10.41,36.45 | v16,38.1 16.09,38.02 U1.25
  Bottom 0.203: JP3.11 4.19,24.13 v5.08,23.24 | v10.41,36.45 10.79,36.83 14.48,36.83 15.75,38.1 v16,38.1
GPIO6
  Top 0.203: R8.3 5.26,26.09 3.76,24.59 3.76,21.95 3.35,21.54 2.59,21.54 JP3.12 2.49,21.64 1.63,21.64 1.32,21.95 1.32,27.33 1.93,27.94 3.15,27.94 3.76,28.55 4.98,28.55 8.53,32.11 8.53,38.41 8.65,38.52 U1.11
GPIO7  (via drill 0.4)
  Top 0.203: JP3.13 2.59,19 3.76,19 4.27,19.51 4.27,24.38 5.08,25.19 R8.4 | U1.12 9.06,38.02 8.94,37.9 8.94,30.99 v8.43,30.48
  Bottom 0.203: v8.43,30.48 6.81,28.85 6.81,24.79 5.89,23.88 5.97,23.8 5.97,21.84 3.17,19.05 JP3.13
L_OUT
  Top 0.813: C2.- 12.7,53.59 14.73,51.56 19.81,51.56 24.38,46.99 JP2.2
LEFT
  Top 0.254: U1.46 12.22,46.84 12.05,47.01 R7.2
  Top 0.406: R3.1 8.97,48.06 10.8,48.06 R7.2
LEFT_FILTERED
  Top 0.406: R7.1 13.88,47.59 12.7,48.77 C2.+
LINE2
  Top 0.203: JP3.1 5.07,49.53 5.85,48.75 7.65,48.75 7.7,48.7 7.7,46.8 8.9,46.8 9.2,46.5 9.2,44.87 9.4,44.67 11.22,44.67 U1.48
MIC_N
  Top 0.203: U1.2 8.6,43.02 7.12,44.5 2.6,44.5 arc60 JP3.3
MIC_P
  Top 0.203: U1.1 8.67,43.52 7.28,44.9 3.9,44.9 2.54,46.26 JP3.2
MISO  (via drill 0.4)
  Top 0.203: CN1.7 8.76,8.51 v8.74,8.53 | v18.29,8.53 18.29,16.26 v18.9,16.87 | v20.73,23.16 20.73,22.55 21.13,22.15 23.57,22.15 24.08,22.66 24.08,24.69 25.3,25.91 25.3,26.57 JP2.10 | U1.30 19.69,40.52 19.71,40.5 20.3,40.5 20.5,40.3 21,40.3 21.65,40.95 v21.67,40.95
  Bottom 0.203: JP2.10 25.35,26.62 24.28,26.62 23.67,27.23 23.67,40.74 23.47,40.95 v21.67,40.95 | v8.74,8.53 v18.29,8.53 | v18.9,16.87 18.9,21.34 v20.73,23.16
MOSI_3V  (via drill 0.4)
  Top 0.203: CN1.3 13.16,13.77 12.29,14.63 12.29,17.37 12.09,17.58 8.43,17.58 8.26,17.75 8.26,21.36 9.14,22.25 13.72,22.25 14.02,22.55 U3.4 14.59,24.44 14.63,24.49 14.63,25.81 14.83,26.01 15.44,26.01 v15.75,26.31 | v20.11,39.63 19.72,40.02 U1.29
  Bottom 0.203: v15.75,26.31 18.19,26.31 20.11,28.24 v20.11,39.63
MOSI_5V  (via drill 0.4)
  Top 0.203: U3.5 12.75,26.16 v12.8,26.21
  Bottom 0.203: v12.8,26.21 12.8,24.99 13.21,24.59 24.94,24.59 JP2.11
N$1
  Top 0.203: R1.1 12.24,34.19 | 11.63,29.1 C5.1 11.61,30.76 Y1.1 11.73,30.89 12.6,30.89 12.7,30.99 12.7,33.83 12.47,34.06 R1.1 | U1.17 13.22,34.86 12.55,34.19 R1.1
N$2
  Top 0.203: U1.18 13.72,34.92 14.45,34.19 R1.2
  Top 0.254: R1.2 14.5,33.06 Y1.2 15.62,32.44 C4.1
N$5
  Top 0.406: C21.1 8.73,51.14 R3.2
N$6
  Top 0.406: C22.1 19.89,45.37 R4.2
R_OUT
  Top 0.813: JP2.1 24.17,49.53 20.25,53.45 18.7,53.45 C1.-
RIGHT
  Top 0.203: 15.71,46.76 15.71,46.95 15.9,47.14 | U1.39 15.72,46.57 R6.2
  Top 0.254: 15.71,46.76 R6.2
  Top 0.406: R4.1 15.9,47.14 15.71,47.14
RIGHT_FILTERED
  Top 0.61: C1.+ 16.07,49.51 15.91,49.35 R6.1
RST_3V  (via drill 0.4, 0.5)
  Top 0.203: U1.3 8.38,42.52 7.62,43.28 6.53,43.28 R2.2 6.43,43.39 6.43,43.08 6.66,42.85 6.66,42.49 6.99,42.16 6.99,42.11 v7.04,42.06 6.56,42.06 5.38,40.88 C26.1 | U3.2 16.56,27.23 16.36,27.43 10.67,27.43 10.16,27.94 10.16,33.73 v10.67,34.24
  Bottom 0.203: v10.67,34.24 6.81,34.24 4.53,36.51 4.53,39.75 6.84,42.06 v7.04,42.06
RST_5V
  Top 0.203: U3.3 15.29,23.01 15.44,22.86 19.61,22.86 20.13,22.34 20.13,21.74 | 20.13,21.74 23.29,21.74 24.28,20.75 24.28,19.3 24.49,19.1 25.35,19.1 JP2.13 | 20.13,21.74 20.13,20.32 R9.1
RX  (via drill 0.4)
  Top 0.203: U1.26 19.29,38.52 19.41,38.4 19.41,37.99 21.13,36.27 21.54,36.27 22.35,37.08 23.98,37.08 24.89,38 26.21,38 26.62,37.59 26.62,10.57 v25.7,9.65 | v6.99,12.95 6.6,13.34 6.6,17.59 R10.1 5.97,18.22 D1.A
  Bottom 0.203: v25.7,9.65 25.2,9.14 20.83,9.14 16.36,13.61 7.64,13.61 v6.99,12.95
RX_5V
  Top 0.203: 5.59,13.97 5.97,13.59 5.97,12.7 6.6,12.06 7.24,12.06 7.87,12.7 7.87,13.46 7.11,14.22 7.11,16.38 7.37,16.64 7.37,20.7 D1.C
  Top 0.254: JP3.15 5.59,13.97
SCLK_3V  (via drill 0.4)
  Top 0.203: CN1.5 10.96,16.98 10.77,17.17 8.13,17.17 7.85,17.45 7.85,21.57 8.94,22.66 11.48,22.66 | 11.48,22.66 13.11,22.66 13.41,22.96 13.41,25.7 13.61,25.91 13.61,26.31 v13.92,26.62 | 11.48,22.66 U3.6 | U1.28 17.1,39.52 v15.72,40.89
  Bottom 0.203: v15.72,40.89 17.73,40.89 19.61,39.01 19.61,28.35 18.39,27.13 15.44,27.13 14.94,26.62 v13.92,26.62
SCLK_5V  (via drill 0.4)
  Top 0.203: U3.7 10.21,25.76 10.36,25.91 11.07,25.91 v11.58,26.42
  Bottom 0.203: v11.58,26.42 11.58,25.6 13.01,24.18 22.81,24.18 JP2.12
SD_DETECT
  Top 0.203: JP3.16 7.87,11.43 8.33,11.89 8.33,15.54 CN1.CD1
SDCS_3V
  Top 0.203: CN1.2 14.26,13.48 12.7,15.04 12.7,19.19 U3.12
SDCS_5V
  Top 0.203: U3.11 11.48,21.13 11.79,21.44 18.29,21.44 18.87,20.85 18.87,18.92 19.14,18.65 R9.3 20.7,18.65 20.98,18.36 20.98,16.61 23.67,13.92 25.35,13.92 JP2.15
TX  (via drill 0.4)
  Top 0.203: U1.27 19.5,39.02 19.91,38.61 19.91,38.19 20.6,37.5 22.3,37.5 22.3,39.4 | v24.08,9.96 25.7,8.33 26.52,8.33 27.03,8.84 27.03,40.16 26.44,40.74 24.29,40.74
  Top 0.254: 22.3,39.4 23.64,40.74 24.29,40.74
  Bottom 0.203: v24.08,9.96 20.73,9.96 16.56,14.12 4.93,14.12 JP3.14
VIN
  pour Top (no thermals): 17.78,30.99 18.8,30.99 18.8,31.88 21.08,31.88 21.08,33.53 26.16,33.53 26.16,35.05 19.68,35.05 19.68,33.02 17.78,33.02
XDCS_3V  (via drill 0.4, 0.5)
  Top 0.203: v16.56,17.07 U3.15 | U1.13 11.22,35.5 11.07,35.36 v10.57,35.36
  Bottom 0.203: 11.58,30.68 9.04,28.14 9.04,20.62 9.45,20.22 13.41,20.22 v16.56,17.07 | 11.27,35.36 v10.57,35.36
  Bottom 0.254: 11.58,30.68 12.6,31.7 12.6,34.5 11.74,35.36 11.27,35.36
XDCS_5V
  Top 0.203: JP2.16 25.35,11.38 24.49,11.38 24.18,11.68 24.18,12.8 20.1,16.88 20.1,17.7 R9.4 18.83,17.75 18.47,18.11 18.47,20.65 18.09,21.03 15.65,21.03 15.29,20.68 U3.14

### Text on the board
tPlace: VS1053B AUDIO | v2 | ROUT | LINE2 | LOUT | MIC+ | AGND | MIC- | AGND | AGND | GND | 3V3 | DREQ | 0 | VCC | 1 | 3V3 | 2 | GND | 3 | MISO | 4 | MOSI | 5 | SCLK | 6 | 7 | RST | CS | TX | SDCS | RX | SD | XDCS | CD | 5V | SAFE
bPlace: OGG, MP3, AAC, WMA, FLAC, MIDI | VS1053B Audio Codec | 3.3V | 3.3 - 5V | OK for use w/powered speakers | LOUT/ROUT: 16Ω Stereo Headphone/Line Out | RX/TX SERIAL: 3-5V safe | SPI: 3-5V safe | GPIO: | VCC: | Supports: